# EAGLE design rpi-sensor-hat (EAGLE 9.2.2)
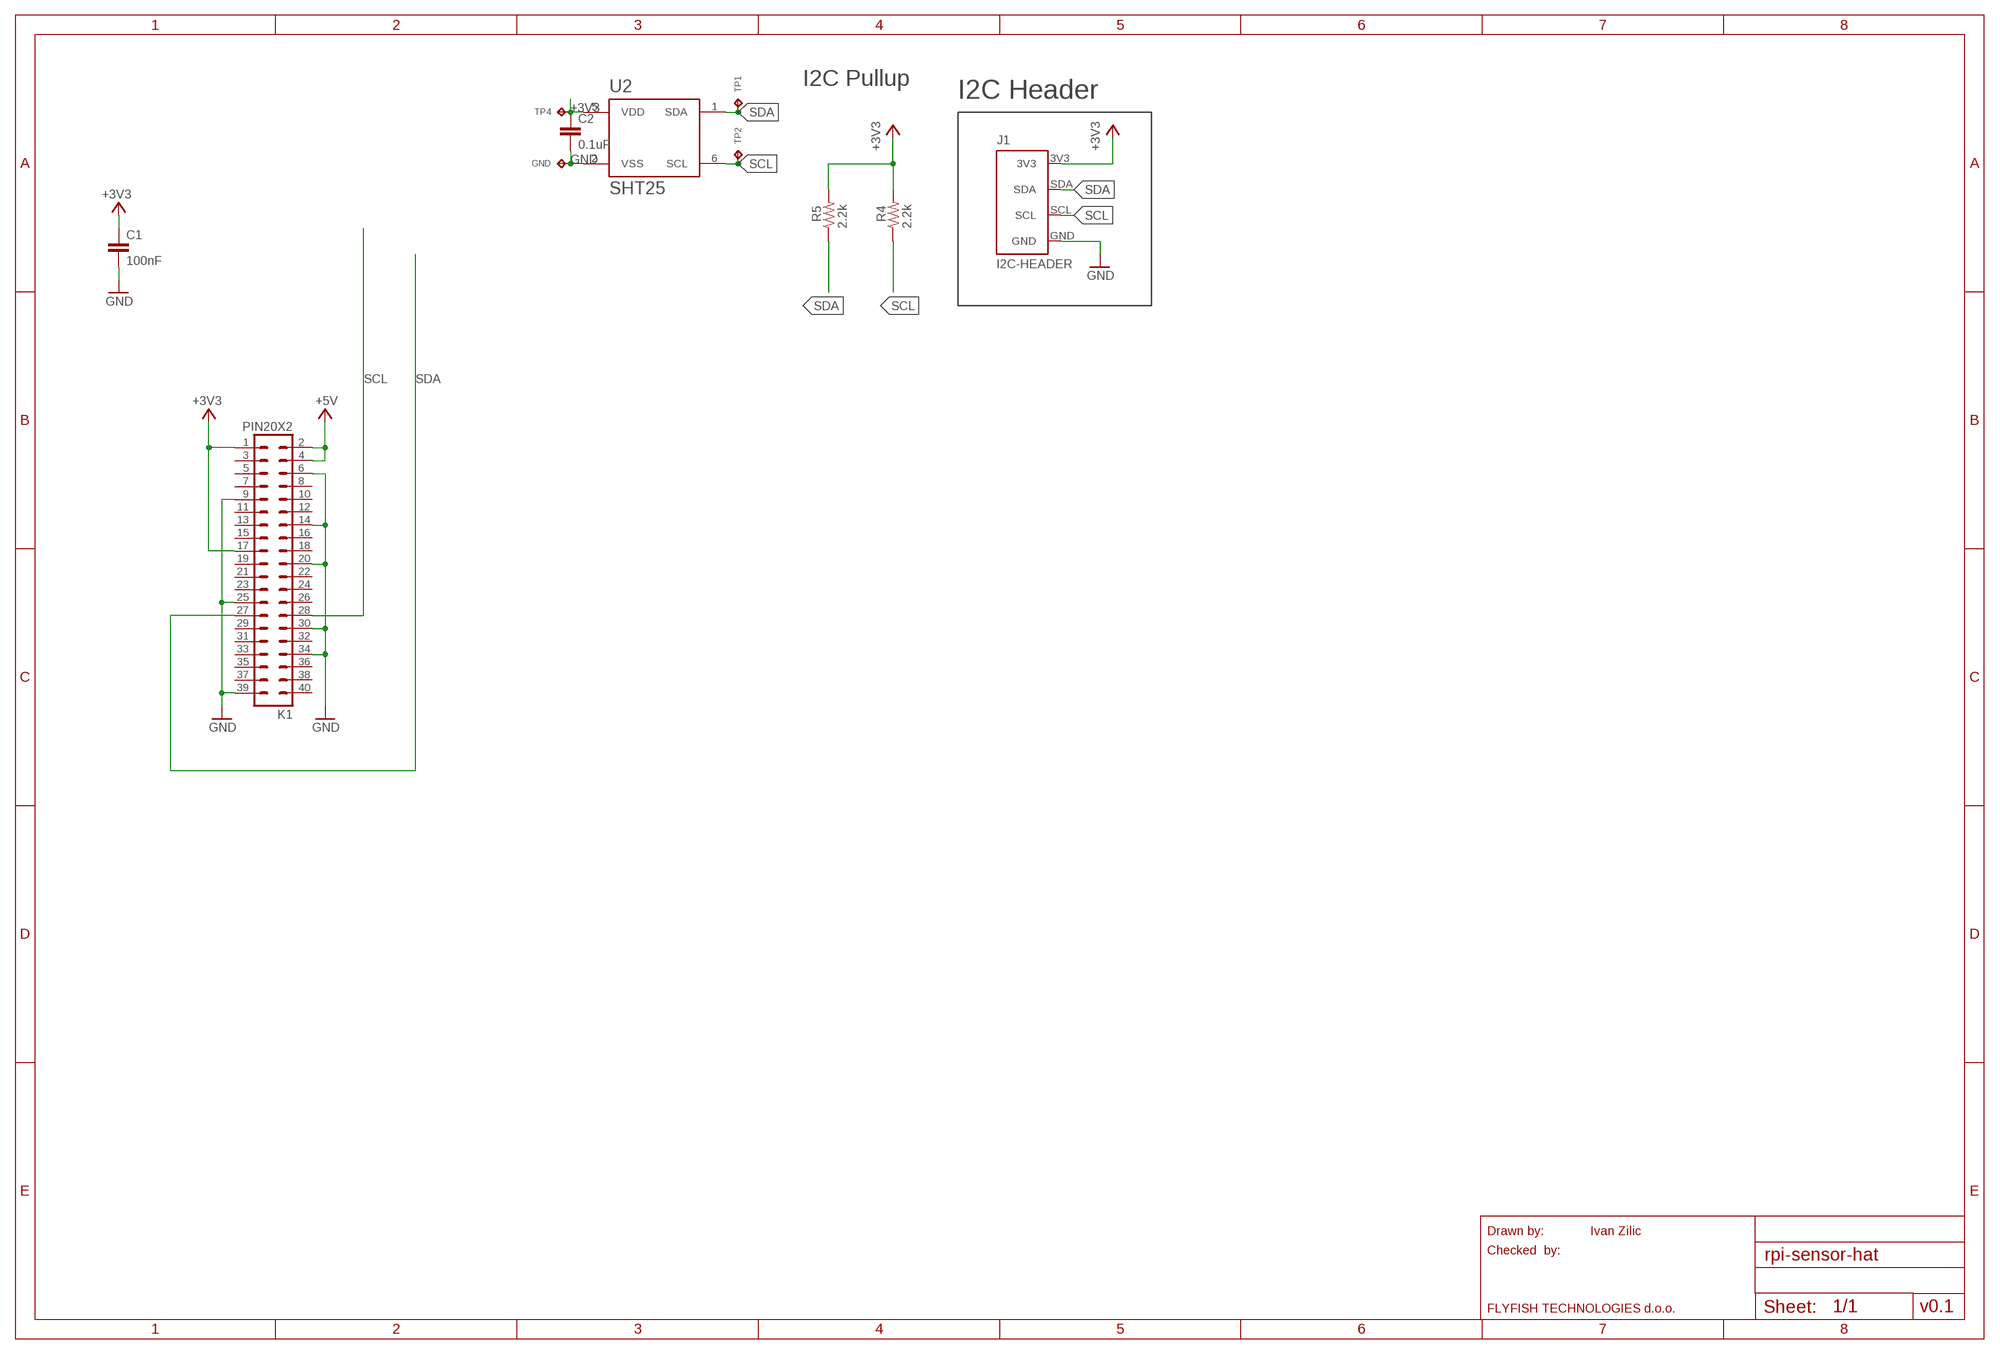
[diagram p0: schematic, sheet 1]

## Parts
C1  100nF  C-EUC0805K  [C0805K]
C2  0.1uF  0.1UF-C0603C104K5RACTU  [C0603]
GND  TPTP06R  [TP06R]
J1  I2C-HEADER  HEADER-I2C  [HEADER-I2C]
K1  PIN20X2  [PIN_20X2]
R4  2.2k  2.2K-RC0603JR-072K2L  [RC0603N]
R5  2.2k  2.2K-RC0603JR-072K2L  [RC0603N]
TP1  TPTP06R  [TP06R]
TP2  TPTP06R  [TP06R]
TP4  TPTP06R  [TP06R]
U2  SHT25  [SHT2X]

## Nets
+3V3: C1.1 C2.1 J1.3V3 K1.1 K1.17 R4.2 R5.2 TP4.TP U2.5(VDD)
+5V: K1.2 K1.4
GND: C1.2 C2.2 GND.TP J1.GND K1.6 K1.9 K1.14 K1.20 K1.25 K1.30 K1.34 K1.39 U2.2(VSS)
SCL: J1.SCL K1.28 R4.1 TP2.TP U2.6(SCL)
SDA: J1.SDA K1.27 R5.1 TP1.TP U2.1(SDA)
Unconnected: K1.3 K1.5 K1.7 K1.8 K1.10 K1.11 K1.12 K1.13 K1.15 K1.16 K1.18 K1.19 K1.21 K1.22 K1.23 K1.24 K1.26 K1.29 K1.31 K1.32 K1.33 K1.35 K1.36 K1.37 K1.38 K1.40

## Notes on the sheet
- I2C Pullup
- I2C Header
- Drawn by: | Ivan Zilic
- Checked  by:
- FLYFISH TECHNOLOGIES d.o.o. | v0.1

## Library data of the parts
C1 = resistor:C-EU: CAPACITOR, European symbol; DIELECTRIC: X7R
C2 = openag-capacitors:0.1UF-C0603C104K5RACTU: CAP CER 0.1UF 50V X7R 0603 Description: 0.1µF ±10% 50V Ceramic Capacitor X7R 0603 (1608 Metric) Technical Specifications: Capacitance: 0.1µF Tolerance: ±10% Rated Voltage: 50V Temperature Coefficient: X7R Operating Temperature: -55°C ~ 125°C Package / Case: 0603 (1608 Metric) Datasheet(s): X7R Dielectric, 6.3-250 VDC <https://search.kemet.com/component-edge/download/datasheet/C0603C104K5RACTU.pdf> Vendor(s): Digikey: 399-5089-1-ND <https://www.digikey.com/product-detail/en/kemet/C0603C104K5RACTU/399-5089-1-ND/1465623>; MANUFACTURER: Kemet; MPN: C0603C104K5RACTU; VENDOR: Digikey; VLINK: https://www.digikey.com/product-detail/en/kemet/C0603C104K5RACTU/399-5089-1-ND/1465623; VPN: 399-5089-1-ND
GND TP1 TP2 TP4 = openag-testpads:TP: Test pad; MPN: N/A
J1 = openag-connectors:HEADER-I2C: 100 MIL HEADER I2C CONNECTIONS; MPN: N/A
K1 = FLYFISH:PIN20X2
R4 R5 = openag-resistors:2.2K-RC0603JR-072K2L: RES SMD 2.2K OHM 5% 1/10W 0603 Description: 2.2 kOhms ±5% 0.1W, 1/10W Chip Resistor 0603 (1608 Metric) Moisture Resistant Thick Film Technical Specifications: Resistance: 2.2 kOhms Tolerance: ±5% Power (Watts): 0.1W, 1/10W Composition: Thick Film Features: Moisture Resistant Temperature Coefficient: ±100ppm/°C Operating Temperature: -55°C ~ 155°C Package / Case: 0603 (1608 Metric) Supplier Device Package: 0603 Size / Dimension: 0.063" L x 0.032" W (1.60mm x 0.80mm) Height - Seated (Max): 0.022" (0.55mm) Number of Terminations: 2 Datasheet(s): RC Series, L Datasheet <http://www.yageo.com/documents/recent/PYu-RC_Group_51_RoHS_L_8.pdf> Chip Resistor Marking <http://www.yageo.com/exep/pages/download/literatures/PYu-R_Marking_2.pdf> Vendor(s): Digikey: 311-2.2KGRCT-ND <https://www.digikey.com/product-detail/en/yageo/RC0603JR-072K2L/311-2.2KGRCT-ND/729676#>; MANUFACTURER: Yageo; MPN: RC0603JR-072K2L; VENDOR: Digikey; VLINK: https://www.digikey.com/product-detail/en/yageo/RC0603JR-072K2L/311-2.2KGRCT-ND/729676#; VPN: 311-2.2KGRCT-ND
U2 = openag-sensors:SHT25: SENSOR HUMI/TEMP 3V I2C 1.8% SMD Description: Humidity Temperature Sensor 0 ~ 100% RH I²C ±1.8% RH 8s Surface Mount Technical Specifications: Sensor Type: Humidity, Temperature Humidity Range: 0 ~ 100% RH Output Type: I²C Output: 12b Accuracy: ±1.8% RH Response Time: 8s Voltage - Supply: 2.1 V ~ 3.6 V Mounting Type: Surface Mount Operating Temperature: -40°C ~ 125°C Datasheet(s): SHTxx Testing Guide <https://www.sensirion.com/fileadmin/user_upload/customers/sensirion/Dokumente/2_Humidity_Sensors/Sensirion_Humidity_Sensors_Testing_Guide_V1.2.pdf> SHTxx Handling Instructions <https://www.sensirion.com/fileadmin/user_upload/customers/sensirion/Dokumente/2_Humidity_Sensors/Sensirion_Humidity_Sensors_Handling_Instructions_V4.pdf> Sensor Specification Statement <https://www.sensirion.com/fileadmin/user_upload/customers/sensirion/Dokumente/2_Humidity_Sensors/Sensirion_Humidity_Sensors_Specification_Statement_V1.pdf> SHTxx, STSxx Assembly SMD Pkgs <https://www.sensirion.com/fileadmin/user_upload/customers/sensirion/Dokumente/2_Humidity_Sensors/Sensirion_Humidity_Sensors_Handling_of_SMD_Packages_V1.pdf> SHT25 Datasheet <https://www.sensirion.com/fileadmin/user_upload/customers/sensirion/Dokumente/2_Humidity_Sensors/Sensirion_Humidity_Sensors_SHT25_Datasheet_V3.pdf> Vendor(s): Digikey: 1649-1008-1-ND <https://www.digikey.com/product-detail/en/sensirion-ag/SHT25/1649-1008-1-ND/5872290>; MANUFACTURER: Sensirion AG; MPN: SHT25; VENDOR: Digikey; VLINK: https://www.digikey.com/product-detail/en/sensirion-ag/SHT25/1649-1008-1-ND/5872290; VPN: 1649-1008-1-ND

## Net classes
0 default: width 0.305 mm, drill 0.254 mm, clearance 0.254 mm

## Board
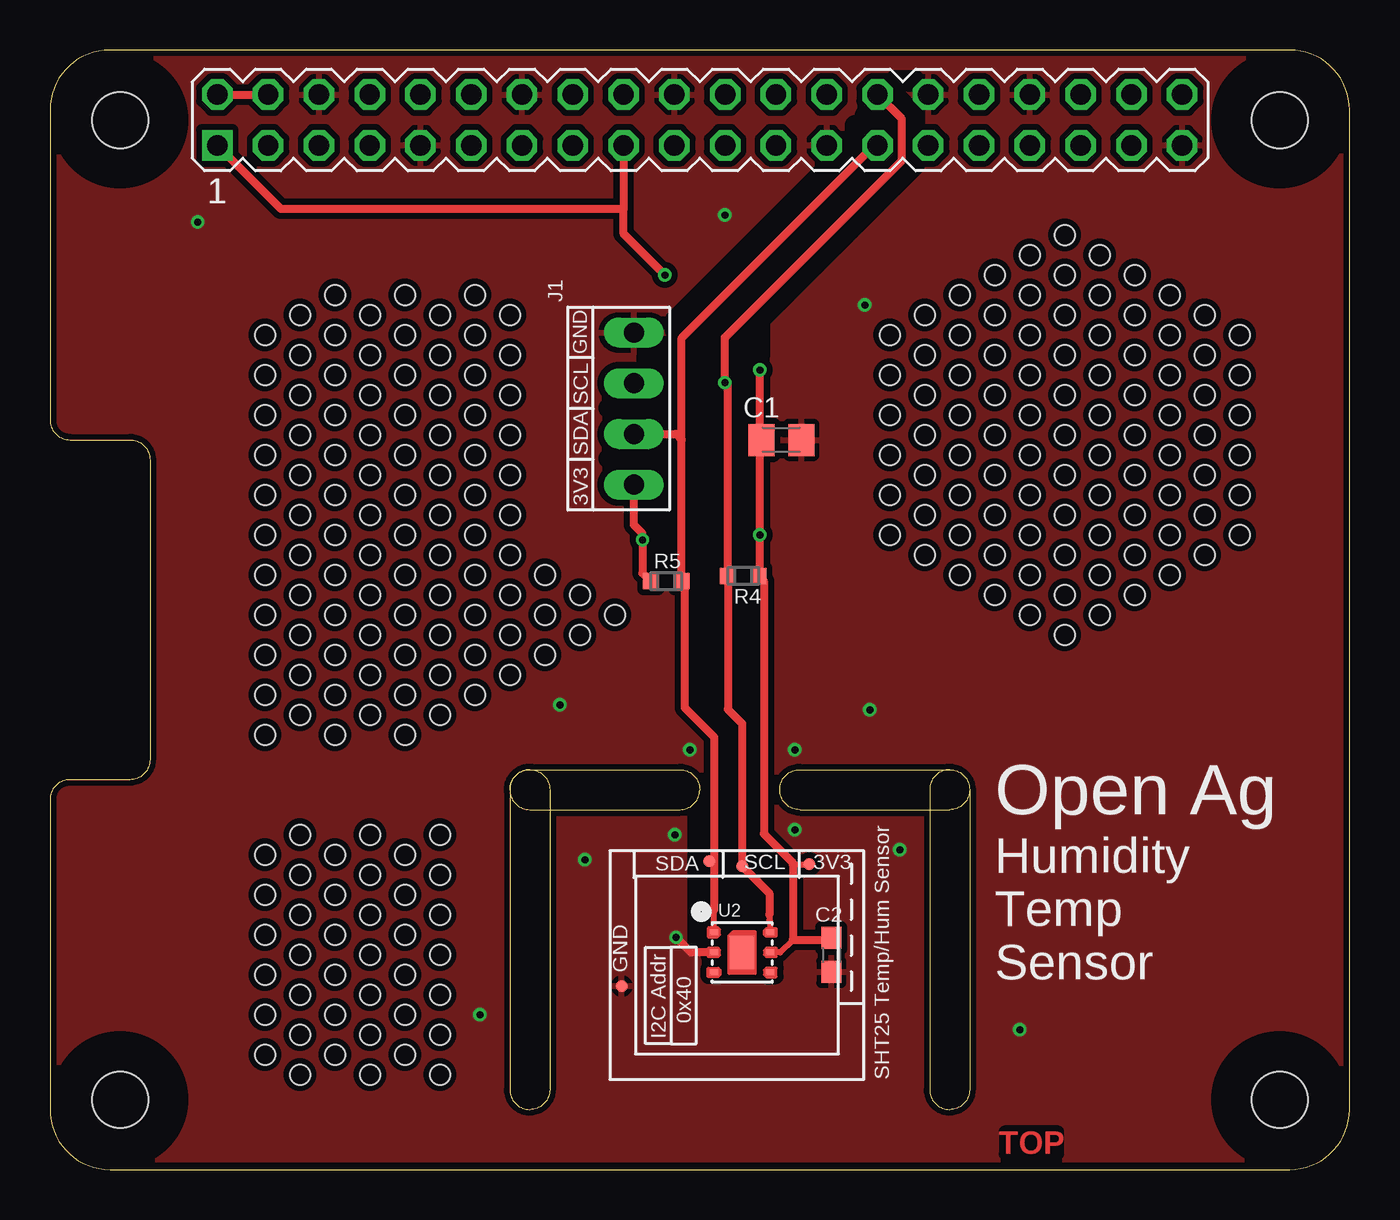
[diagram p1: board, top side]
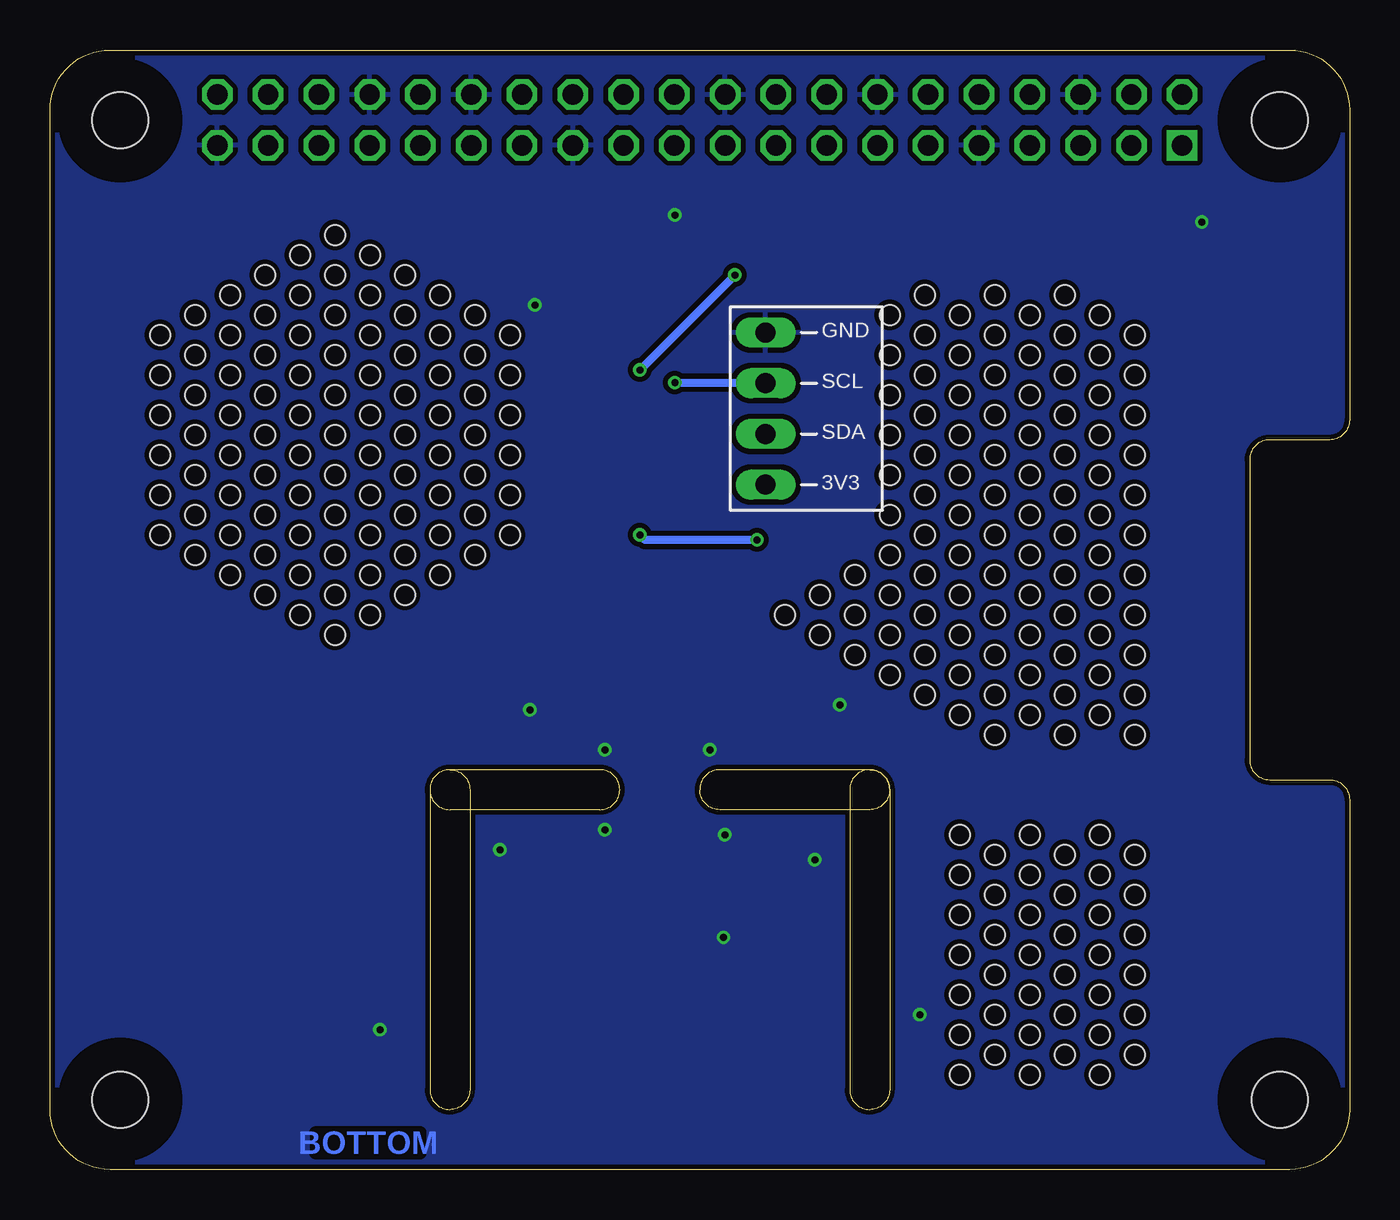
[diagram p2: board, bottom side, seen from below]

Size 65 x 56 mm. Coordinates in mm from the lower left corner, seen from the top.
Outline: 46,19 46,4 arc-90 45,3 arc-90 44,4 44,19 arc-90 45,20
Outline: 45,20 arc-90 46,19
Outline: 23,19 23,4 arc90 24,3 arc90 25,4 25,19 arc90 24,20
Outline: 24,20 arc90 23,19
Outline: 24,20 31.5,20 arc-90 32.5,19 arc-90 31.5,18 24,18 arc-90 23,19
Outline: 23,19 arc-90 24,20
Outline: 45,20 37.5,20 arc90 36.5,19 arc90 37.5,18 45,18 arc90 46,19
Outline: 45,20 arc-90 46,19
Outline: 0,3 arc90 3,0 62,0 arc90 65,3 65,53 arc90 62,56 3,56 arc90 0,53 0,37.5 arc90 1,36.5 4,36.5 arc-90 5,35.5 5,20.5 arc-90 4,19.5 1,19.5 arc90 0,18.5 0,3
Copper layers (1*16): Top 0.035mm / dielectric 1.5mm / Bottom 0.035mm
Design rules "ITEADstudio_DRC": minimum track width 6mil, minimum drill 12mil, track to track 6mil, track to pad 6mil, pad to pad 6mil, via to via 6mil, smd to smd 0mil, copper to edge 10mil, drill to drill 10mil, minimum pad ring 10mil, minimum via ring 6mil, stop-mask expansion 2mil, vias tented up to drill 100mil, thermal gap 10mil
Holes 2.8 mm at 3.5,3.5 3.5,52.5 61.5,52.5 61.5,3.5
Holes 1 mm at 23,42.75 23,40.75 23,38.75 23,36.75 23,34.75 23,32.75 23,30.75 23,28.75 23,26.75 23,24.75 21.25,41.75 21.25,39.75 21.25,37.75 21.25,35.75 21.25,33.75 21.25,31.75 21.25,29.75 21.25,27.75 21.25,25.75 19.5,40.75 19.5,42.75 19.5,38.75 19.5,36.75 19.5,34.75 19.5,32.75 19.5,30.75 19.5,28.75 19.5,26.75 19.5,24.75 17.75,41.75 17.75,39.75 17.75,37.75 17.75,35.75 17.75,33.75 17.75,31.75 17.75,29.75 17.75,27.75 17.75,25.75 16,26.75 16,28.75 16,30.75 16,32.75 16,34.75 16,36.75 16,38.75 16,40.75 16,42.75 16,24.75 17.75,23.75 21.25,23.75 19.5,22.75 16,22.75 17.75,21.75 14.25,21.75 14.25,23.75 14.25,25.75 14.25,27.75 14.25,29.75 14.25,31.75 14.25,33.75 14.25,35.75 14.25,37.75 14.25,39.75 14.25,41.75 12.5,22.75 12.5,24.75 12.5,26.75 12.5,28.75 12.5,30.75 12.5,32.75 12.5,34.75 12.5,36.75 12.5,38.75 12.5,40.75 12.5,42.75 24.75,25.75 24.75,27.75 24.75,29.75 26.5,28.75 26.5,26.75 28.25,27.75 21.25,43.75 17.75,43.75 14.25,43.75 10.75,41.75 10.75,39.75 10.75,37.75 10.75,35.75 10.75,33.75 10.75,31.75 10.75,29.75 10.75,27.75 10.75,25.75 10.75,23.75 10.75,21.75 42,31.75 42,33.75 42,35.75 42,37.75 42,39.75 42,41.75 43.75,30.75 43.75,32.75 43.75,34.75 43.75,36.75 43.75,38.75 43.75,40.75 43.75,42.75 45.5,29.75 45.5,31.75 45.5,33.75 45.5,35.75 45.5,37.75 45.5,39.75 45.5,41.75 45.5,43.75 47.25,42.75 47.25,40.75 47.25,38.75 47.25,36.75 47.25,34.75 47.25,32.75 47.25,30.75 47.25,44.75 49,43.75 49,41.75 49,39.75 49,35.75 49,37.75 49,33.75 49,31.75 49,45.75 50.75,44.75 50.75,42.75 50.75,40.75 50.75,38.75 50.75,36.75 50.75,34.75 50.75,32.75 50.75,46.75 52.5,45.75 52.5,43.75 52.5,41.75 52.5,39.75 52.5,37.75 52.5,35.75 52.5,33.75 52.5,31.75 54.25,44.75 54.25,42.75 54.25,40.75 54.25,38.75 54.25,36.75 54.25,34.75 54.25,32.75 54.25,30.75 56,43.75 56,41.75 56,39.75 56,37.75 56,35.75 56,33.75 56,31.75 56,29.75 57.75,42.75 57.75,40.75 57.75,38.75 57.75,36.75 57.75,34.75 57.75,32.75 57.75,30.75 59.5,41.75 59.5,39.75 59.5,37.75 59.5,35.75 59.5,33.75 59.5,31.75 50.75,30.75 49,29.75 52.5,29.75 47.25,28.75 50.75,28.75 54.25,28.75 49,27.75 52.5,27.75 50.75,26.75 12.5,12.75 12.5,10.75 12.5,8.75 12.5,6.75 12.5,4.75 10.75,11.75 10.75,9.75 10.75,7.75 10.75,5.75 14.25,5.75 14.25,7.75 14.25,9.75 14.25,11.75 14.25,13.75 16,12.75 16,14.75 16,10.75 16,8.75 16,6.75 17.75,13.75 17.75,11.75 17.75,9.75 17.75,7.75 17.75,5.75 16,4.75 17.75,15.75 19.5,14.75 19.5,12.75 19.5,10.75 19.5,8.75 19.5,6.75 19.5,4.75 19.5,16.75 16,16.75 14.25,15.75 12.5,14.75 10.75,13.75 10.75,15.75 12.5,16.75
tRestrict: area 1.9,51 to 5,54; area 60,51 to 63,54; area 60,1.9 to 63,5; area 1.9,1.9 to 5,5; 14 lines
bRestrict: area 1.9,1.9 to 5,5; area 1.9,51 to 5,54; area 60,1.9 to 63,5; area 60,51 to 63,54
Milling: 6 lines

### Footprints (pad centres in the part's own frame; a part is rotated, then mirrored left to right if it is on the bottom)
C0805K = smd 1.3 x 1.6: 1 -1,0; 2 1,0
C0603 = smd 1.1 x 1: 1 -0.85,0; 2 0.85,0
TP06R = smd 0.6 x 0.6: TP 0,0
HEADER-I2C = drill 1 long: 3V3 3.81,0.762; GND -3.81,0.762; SCL -1.27,0.762; SDA 1.27,0.762
PIN_20X2 = drill 1.016 square: 1 -24.13,-1.27 | drill 1.016 octagon: 2 -24.13,1.27; 3 -21.59,-1.27; 4 -21.59,1.27; 5 -19.05,-1.27; 6 -19.05,1.27; 7 -16.51,-1.27; 8 -16.51,1.27; 9 -13.97,-1.27; 10 -13.97,1.27; 11 -11.43,-1.27; 12 -11.43,1.27; 13 -8.89,-1.27; 14 -8.89,1.27; 15 -6.35,-1.27; 16 -6.35,1.27; 17 -3.81,-1.27; 18 -3.81,1.27; 19 -1.27,-1.27; 20 -1.27,1.27; 21 1.27,-1.27; 22 1.27,1.27; 23 3.81,-1.27; 24 3.81,1.27; 25 6.35,-1.27; 26 6.35,1.27; 27 8.89,-1.27; 28 8.89,1.27; 29 11.43,-1.27; 30 11.43,1.27; 31 13.97,-1.27; 32 13.97,1.27; 33 16.51,-1.27; 34 16.51,1.27; 35 19.05,-1.27; 36 19.05,1.27; 37 21.59,-1.27; 38 21.59,1.27; 39 24.13,-1.27; 40 24.13,1.27
RC0603N = smd 0.756 x 0.8: 1 -0.778,0; 2 0.778,0
SHT2X = smd 0.3 x 0.4: 1 -1,-1.4; 2 0,-1.4; 3 1,-1.4; 4 1,1.4; 5 0,1.4; 6 -1,1.4 | smd 1.651 x 1.27: 7 0,0

### Placement (x,y rotation side)
C1  36.58,36.5 0 top
C2  39.08,10.73 270 top
GND  28.6,9.18 90 top
J1  28.44,38.06 270 top
K1  32.5,52.5 0 top
R4  34.68,29.7 0 top
R5  30.82,29.43 180 top
TP1  32.96,15.43 90 top
TP2  34.62,15.18 90 top
TP4  37.98,15.27 90 top
U2  34.61,10.86 270 top

### Tracks (layer width: path | path; a pad name or v marks a point on that pad's centre or on a via)
+3V3  (via drill 0.35)
  Top 0.305: 35.5,36.5 C1.1 | 37.16,15.35 37.16,15.25 37.97,15.25 TP4.TP | 39,11.5 C2.1 | 37.16,11.5 36.52,10.86 U2.5
  Top 0.406: 39,11.5 37.16,11.5 37.16,15.25 | K1.17 28.69,48.06 | K1.1 11.54,48.06 28.69,48.06 | 37.16,15.35 35.71,16.79 35.71,29.45 R4.2 35.5,29.74 v35.5,31.75 35.5,36.5 | J1.3V3 29.2,32.25 29.64,31.82 v29.64,31.5 29.64,29.84 R5.2 | C1.1 35.5,36.57 v35.5,40 | v30.75,44.75 28.69,46.81 28.69,48.06
  Bottom 0.406: v29.64,31.5 35.25,31.5 v35.5,31.75 | v35.5,40 v30.75,44.75
+5V
  Top 0.406: K1.2 K1.4
GND  (via drill 0.35)
  Top 0.406: U2.2 32.08,10.86 v31.31,11.62
  other vias: 7.39,47.4 33.75,47.75 40.75,43.25 41,23 25.5,23.25 26.75,15.5 21.5,7.75 42.5,16 48.5,7 32,21 31.25,16.75 37.25,17 37.25,21
  pour Bottom: 0,3 arc90 3,0 62,0 arc90 65,3 65,53 arc90 62,56 3,56 arc90 0,53 0,37.5 arc90 1,36.5 4,36.5 arc-90 5,35.5 5,20.5 arc-90 4,19.5 1,19.5 arc90 0,18.5
  pour Top (isolate 0.305): 66.71,0.51 66.71,55.94 -0.99,55.94 -0.99,0.51
SCL  (via drill 0.35)
  Top 0.305: U2.6 36,11.88 36,12.46 35.98,12.48 35.98,12.75 | TP2.TP 34.55,15.25
  Top 0.406: 35.98,12.75 35.98,13.82 TP2.TP 34.62,22.3 33.9,23.02 R4.1 33.9,39.22 v33.75,39.37 33.75,41.62 42.61,50.48 42.61,52.55 K1.28
  Bottom 0.406: v33.75,39.37 29.23,39.37 J1.SCL
SDA
  Top 0.305: U2.1 33.22,13 33.22,15.18 | TP1.TP 33.22,15.18 | 33.22,15.75 33.22,15.18
  Top 0.406: 33.22,13 33.22,15.75 33.22,21.64 31.75,23.1 31.75,29.28 R5.1 31.6,36.5 | 31.6,36.5 31.6,41.6 41.23,51.23 K1.27 41.39,51.11 | J1.SDA 31.31,36.79 31.6,36.5

### Text on the board
Top: TOP
Bottom: BOTTOM
tPlace: SDA | SCL | 3V3 | GND | I2C Addr | 0x40 | SHT25 Temp/Hum Sensor
tNames: Open Ag | Humidity / Temp / Sensor